# EAGLE schematic M466 and M462B Output Amplifier (EAGLE 7.2.0)
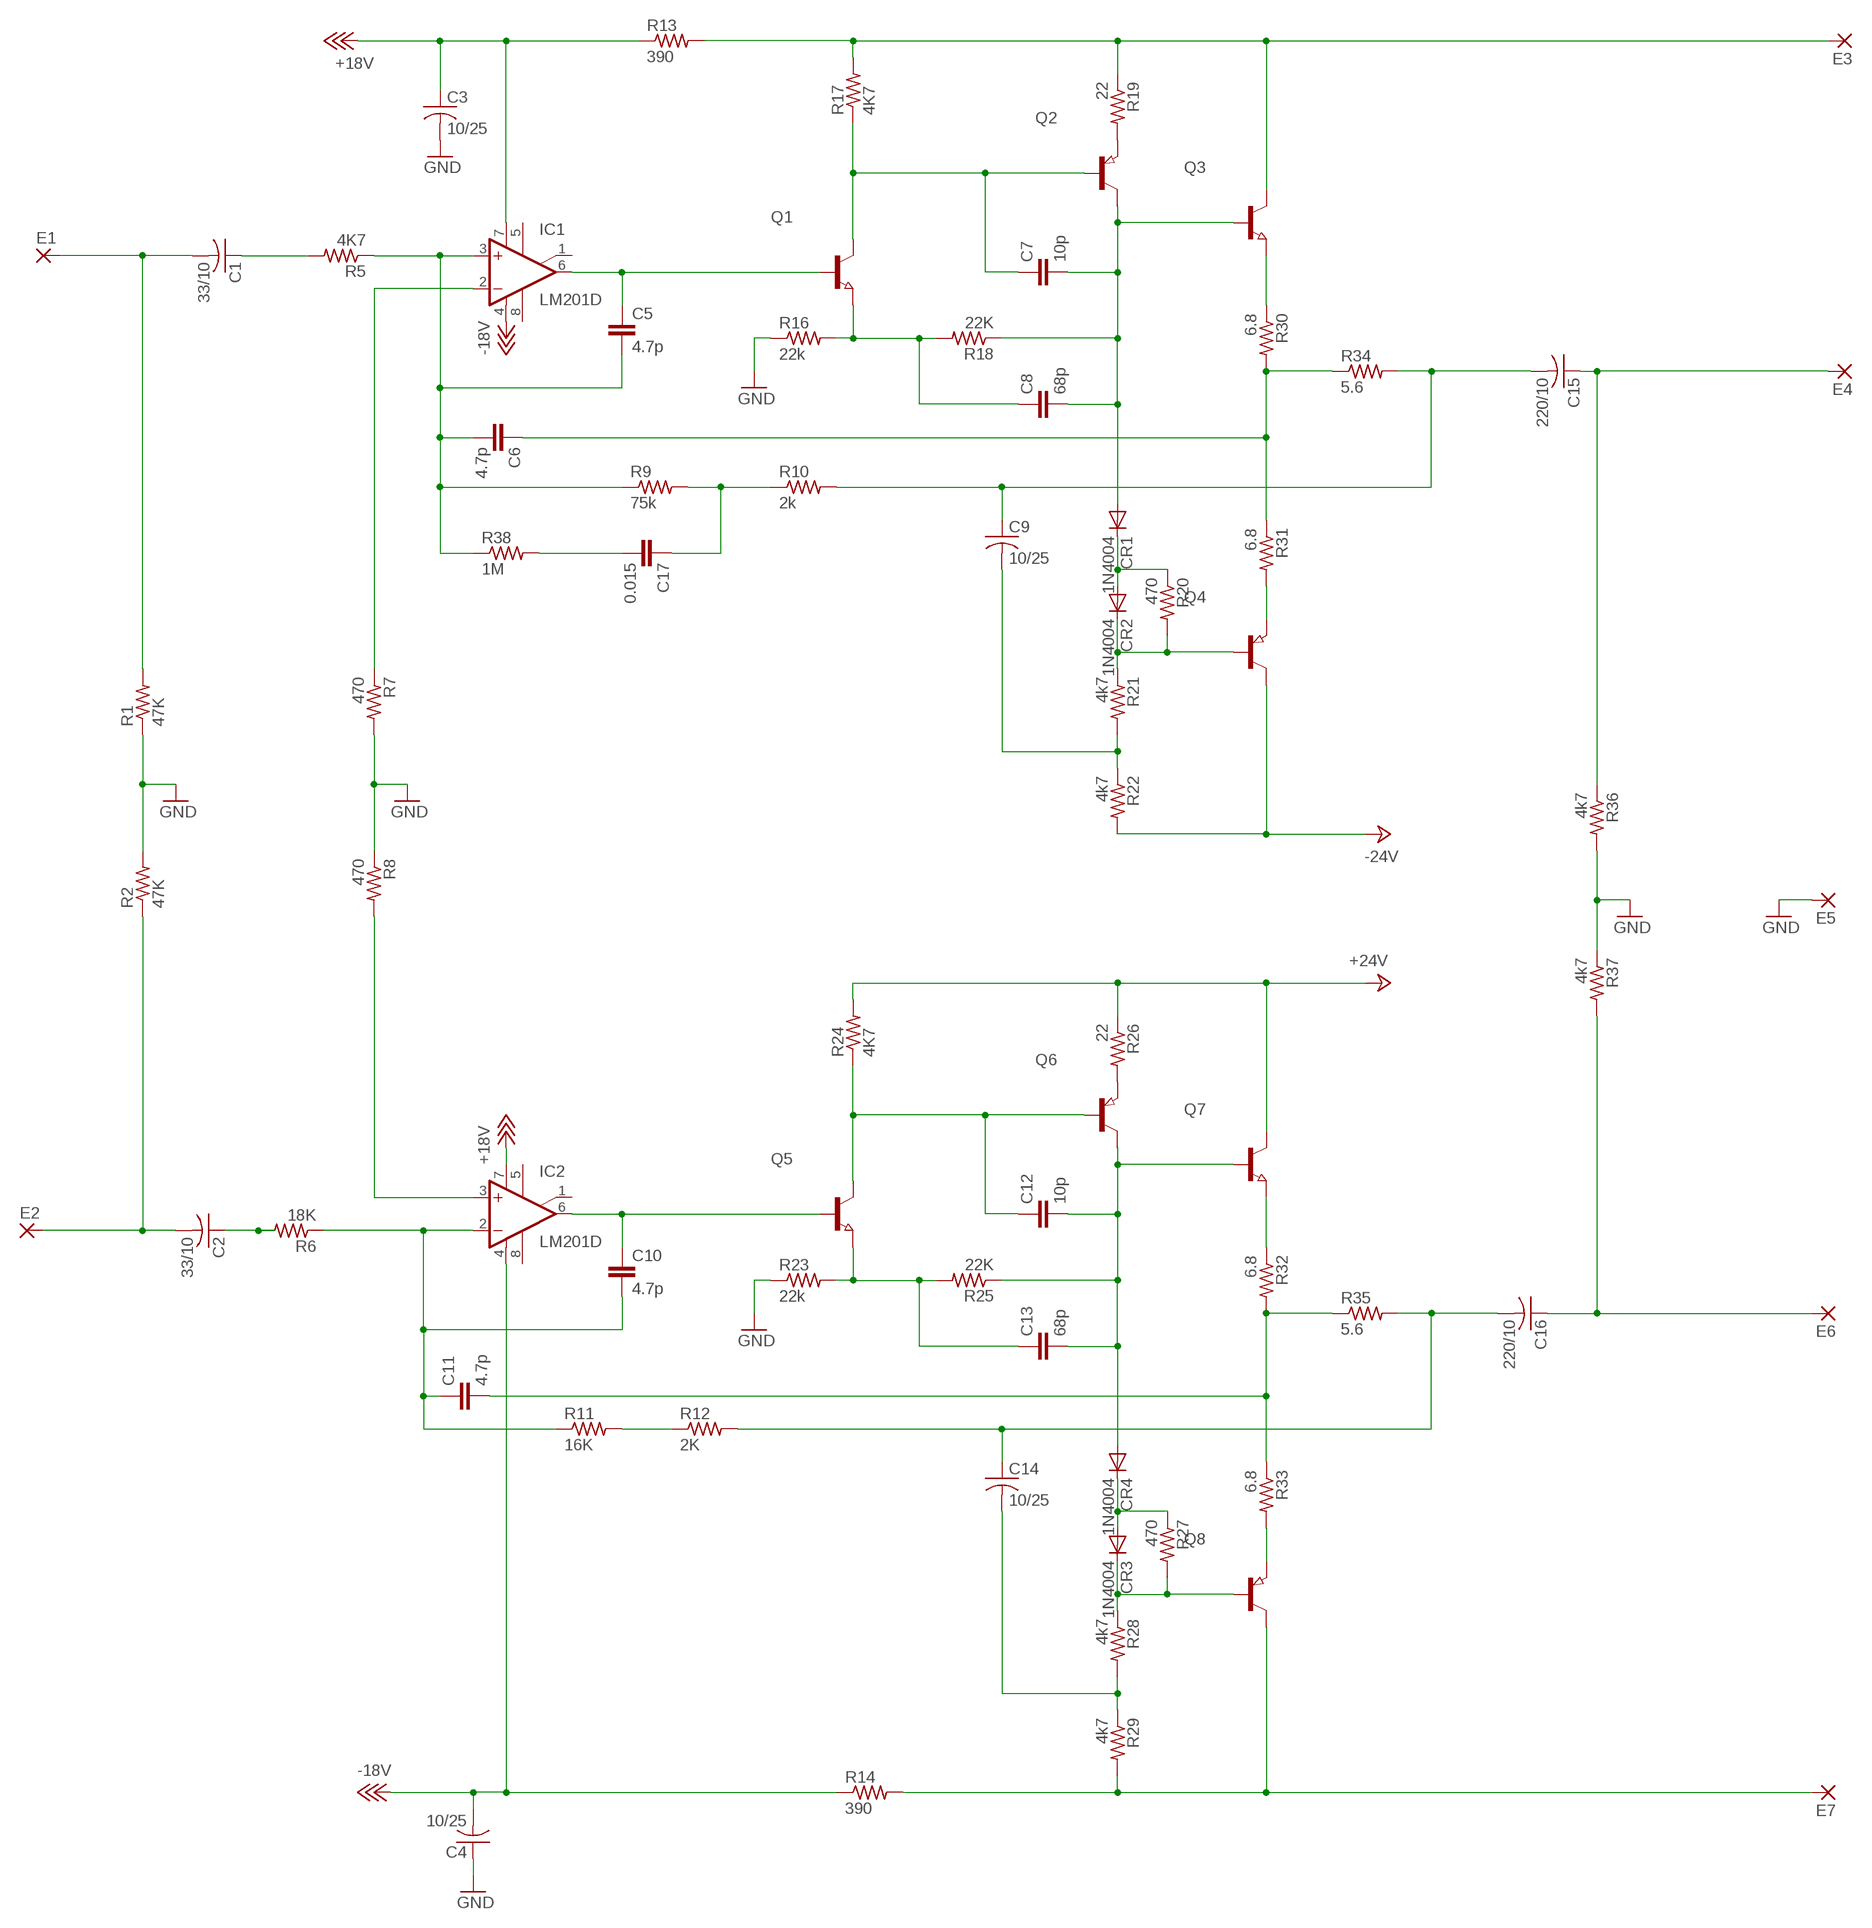
[diagram p0: schematic, sheet 1]

## Parts
C1  33/10  C-USC0805  [C0805]
C2  33/10  C-USC0805  [C0805]
C3  10/25  C-USC0805  [C0805]
C4  10/25  C-USC0805  [C0805]
C5  4.7p  C2.5/5  [C2.5-5]
C6  4.7p  C2.5/5  [C2.5-5]
C7  10p  C2.5/5  [C2.5-5]
C8  68p  C2.5/5  [C2.5-5]
C9  10/25  C-USC0805  [C0805]
C10  4.7p  C2.5/5  [C2.5-5]
C11  4.7p  C2.5/5  [C2.5-5]
C12  10p  C2.5/5  [C2.5-5]
C13  68p  C2.5/5  [C2.5-5]
C14  10/25  C-USC0805  [C0805]
C15  220/10  C-USC0805  [C0805]
C16  220/10  C-USC0805  [C0805]
C17  0.015  C2.5/5  [C2.5-5]
CR1  1N4004  [DO41-10]
CR2  1N4004  [DO41-10]
CR3  1N4004  [DO41-10]
CR4  1N4004  [DO41-10]
E1  SMD2  [SMD1,27-2,54]
E2  SMD2  [SMD1,27-2,54]
E3  SMD2  [SMD1,27-2,54]
E4  SMD2  [SMD1,27-2,54]
E5  SMD2  [SMD1,27-2,54]
E6  SMD2  [SMD1,27-2,54]
E7  SMD2  [SMD1,27-2,54]
IC1  LM201D  [SO08]
IC2  LM201D  [SO08]
Q1  NPN-TRANSISTOR_SOT23  [SOT23]
Q2  PNP-TRANSISTOR_SOT23  [SOT23]
Q3  NPN-TRANSISTOR_SOT23  [SOT23]
Q4  PNP-TRANSISTOR_SOT23  [SOT23]
Q5  NPN-TRANSISTOR_SOT23  [SOT23]
Q6  PNP-TRANSISTOR_SOT23  [SOT23]
Q7  NPN-TRANSISTOR_SOT23  [SOT23]
Q8  PNP-TRANSISTOR_SOT23  [SOT23]
R1  47K  R-US_R0805  [R0805]
R2  47K  R-US_R0805  [R0805]
R5  4K7  R-US_R0805  [R0805]
R6  18K  R-US_R0805  [R0805]
R7  470  R-US_R0805  [R0805]
R8  470  R-US_R0805  [R0805]
R9  75k  R-US_R0805  [R0805]
R10  2k  R-US_R0805  [R0805]
R11  16K  R-US_R0805  [R0805]
R12  2K  R-US_R0805  [R0805]
R13  390  R-US_R0805  [R0805]
R14  390  R-US_R0805  [R0805]
R16  22k  R-US_R0805  [R0805]
R17  4K7  R-US_R0805  [R0805]
R18  22K  R-US_R0805  [R0805]
R19  22  R-US_R0805  [R0805]
R20  470  R-US_R0805  [R0805]
R21  4k7  R-US_R0805  [R0805]
R22  4k7  R-US_R0805  [R0805]
R23  22k  R-US_R0805  [R0805]
R24  4K7  R-US_R0805  [R0805]
R25  22K  R-US_R0805  [R0805]
R26  22  R-US_R0805  [R0805]
R27  470  R-US_R0805  [R0805]
R28  4k7  R-US_R0805  [R0805]
R29  4k7  R-US_R0805  [R0805]
R30  6.8  R-US_R0805  [R0805]
R31  6.8  R-US_R0805  [R0805]
R32  6.8  R-US_R0805  [R0805]
R33  6.8  R-US_R0805  [R0805]
R34  5.6  R-US_R0805  [R0805]
R35  5.6  R-US_R0805  [R0805]
R36  4k7  R-US_R0805  [R0805]
R37  4k7  R-US_R0805  [R0805]
R38  1M  R-US_R0805  [R0805]

## Nets
+18V: C3.1 IC1.7(V+) IC2.7(V+) R13.1
+24V: Q7.3(C) R24.2 R26.1
-18V: C4.2 IC1.4(V-) IC2.4(V-) R14.1
-24V: Q4.3(C) R22.2
GND: C3.2 C4.1 E5.1(P) R1.1 R2.2 R7.2 R8.1 R16.1 R23.1 R36.2 R37.1
N$1: C1.2 E1.1(P) R1.2
N$2: IC1.2(-IN) R7.1
N$3: C1.1 R5.2
N$4: IC2.3(+IN) R8.2
N$5: C10.2 C11.1 IC2.2(-IN) R6.1 R11.1
N$6: C2.1 R6.2
N$7: C2.2 E2.1(P) R2.1
N$8: C5.1 IC1.6(OUT) Q1.1(B)
N$9: C5.2 C6.2 IC1.3(+IN) R5.1 R9.1 R38.1
N$10: C17.1 R9.2 R10.1
N$11: C17.2 R38.2
N$12: C10.1 IC2.6(OUT) Q5.1(B)
N$13: R11.2 R12.1
N$14: C8.1 Q1.2(E) R16.2 R18.2
N$15: C9.2 R21.2 R22.1
N$16: C7.1 Q1.3(C) Q2.1(B) R17.1
N$17: E3.1(P) Q3.3(C) R13.2 R17.2 R19.1
N$18: C7.2 C8.2 CR1.A Q2.3(C) Q3.1(B) R18.1
N$19: CR2.C Q4.1(B) R20.2 R21.1
N$20: Q2.2(E) R19.2
N$22: C16.1 E6.1(P) R37.2
N$23: C6.1 R30.2 R31.1 R34.1
N$24: Q3.2(E) R30.1
N$25: Q4.2(E) R31.2
N$26: C9.1 C15.2 R10.2 R34.2
N$28: C13.1 Q5.2(E) R23.2 R25.2
N$29: CR1.C CR2.A R20.1
N$30: C12.1 Q5.3(C) Q6.1(B) R24.1
N$32: C12.2 C13.2 CR4.A Q6.3(C) Q7.1(B) R25.1
N$33: Q6.2(E) R26.2
N$34: C11.2 R32.2 R33.1 R35.1
N$35: Q7.2(E) R32.1
N$36: C14.2 R28.2 R29.1
N$37: CR3.C Q8.1(B) R27.2 R28.1
N$38: Q8.2(E) R33.2
N$39: E7.1(P) Q8.3(C) R14.2 R29.2
N$40: CR3.A CR4.C R27.1
N$41: C14.1 C16.2 R12.2 R35.2
N$42: C15.1 E4.1(P) R36.1
Unconnected: IC1.1(ON/CMP) IC1.5(ON) IC1.8(CMP) IC2.1(ON/CMP) IC2.5(ON) IC2.8(CMP)

## Library data of the parts
C1-C4 C9 C14-C16 = adafruit:C-US: CAPACITOR, American symbol
C5-C8 C10-C13 C17 = capacitor-wima:C: CAPACITOR naming: grid - package width
CR1-CR4 = adafruit:1N4004: DIODE General purpose 1N400x type rectifier (With bigger pads) http://www.ladyada.net/library/pcb/eaglelibrary.html
E1-E7 = wirepad:SMD2: SMD PAD
IC1 IC2 = linear:LM201: OP AMP
Q1 Q3 Q5 Q7 = semicon-smd-ipc:NPN-TRANSISTOR_: NPN TRANSISTOR
Q2 Q4 Q6 Q8 = semicon-smd-ipc:PNP-TRANSISTOR_: PNP TRANSISTOR
R1 R2 R5-R14 R16-R38 = adafruit:R-US_: RESISTOR, American symbol